# EAGLE schematic DIY-e-bike-thumb-throttle v1 (EAGLE 7.6.0)
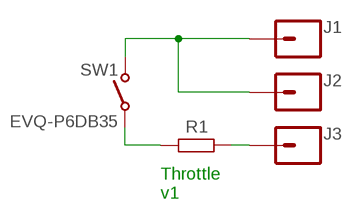
[diagram p0: schematic, sheet 1]

## Parts
J1  M01SMD-4.5X1.5  [PAD-1.5X4.5]
J2  M01SMD-4.5X1.5  [PAD-1.5X4.5]
J3  M01SMD-4.5X1.5  [PAD-1.5X4.5]
R1  SMD-R-0603-SMALL  [0603-SMALL]
SW1  EVQ-P6DB35  TACTILE-IP68  [TACTILE_SWITCH_SMD-2]

## Nets
N$1: J3.P$1 R1.2
N$2: R1.1 SW1.2(P) SW1.3(P)
N$3: J1.P$1 J2.P$1 SW1.1(O) SW1.4(O)

## Notes on the sheet
- Throttle 
  v1

## Library data of the parts
J1-J3 = SparkFun-Connectors:M01: Header 1 Standard 1-pin 0.1" header. Use with straight break away headers (SKU : PRT-00116), right angle break away headers (PRT-00553), swiss pins (PRT-00743), machine pins (PRT-00117), and female headers (PRT-00115). SMTSO-256-ET is a "flush mount" nut for a 4-40 screw. The older package used to be too tight, and did not allow it to sit properly thru the drill hit. The latest (0.165DIA) fits nice and snug.
R1 = ALBERT:SMD-R: Resistors all kinds in 0603 and 0402
SW1 = ALBERT:TACTILE